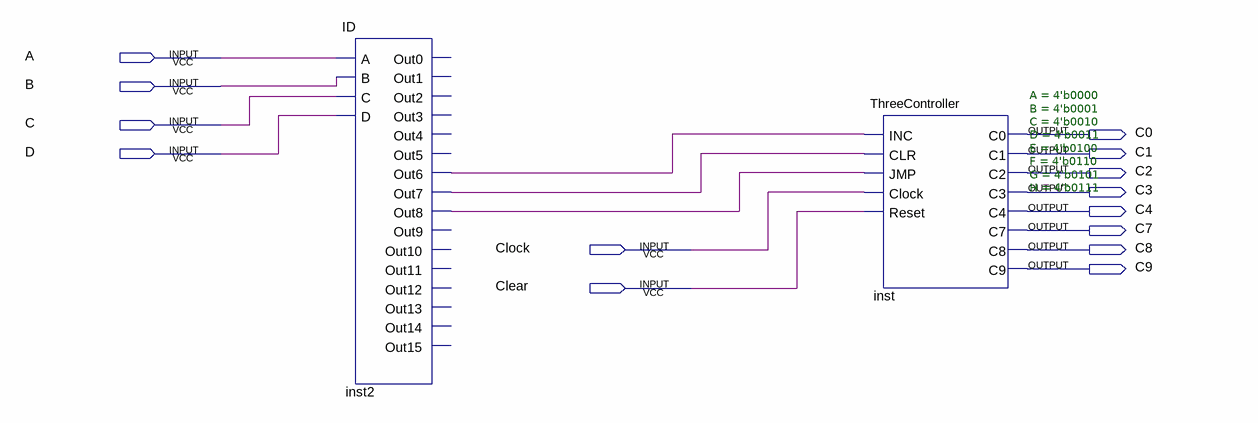
[diagram p0: schematic sheet]
// Quartus schematic ThreeController.bdf as structural Verilog: 2 symbols, 14 pins
module ThreeController (
  input  A,
  input  B,
  input  C,
  input  D,
  input  Clock,
  input  Clear,
  output C0,
  output C1,
  output C2,
  output C3,
  output C4,
  output C7,
  output C8,
  output C9
);

  wire inst2_out6, inst2_out7, inst2_out8;

  ID inst2 (
    .A(A), .B(B), .C(C), .D(D), .Out6(inst2_out6), .Out7(inst2_out7), .Out8(inst2_out8));  // open: Out0, Out1, Out2, Out3, Out4, Out5, Out9, Out10, Out11, Out12, Out13, Out14, Out15
  ThreeController #(.A(4'b0000), .B(4'b0001), .C(4'b0010), .D(4'b0011), .E(4'b0100), .F(4'b0110), .G(4'b0101), .H(4'b0111)) inst (
    .INC(inst2_out6), .CLR(inst2_out7), .JMP(inst2_out8), .Clock(Clock), .Reset(Clear), .C0(C0), .C1(C1),
    .C2(C2), .C3(C3), .C4(C4), .C7(C7), .C8(C8), .C9(C9));
endmodule
